# EasyEDA Pro project Jalousee PCB.eprj, board PCB3
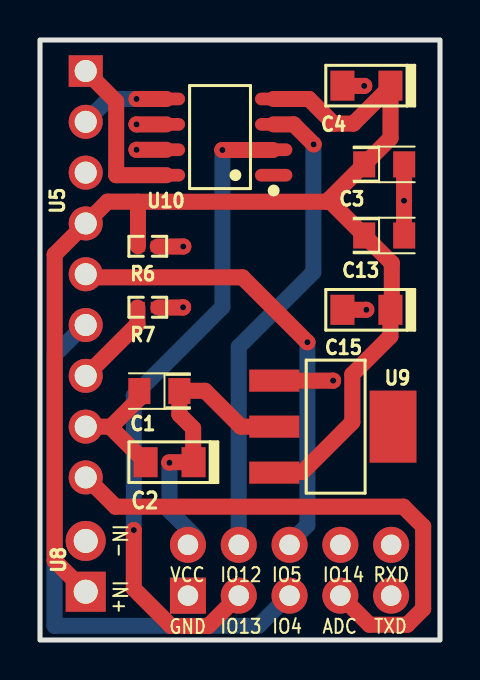
[diagram p11: board, top side]
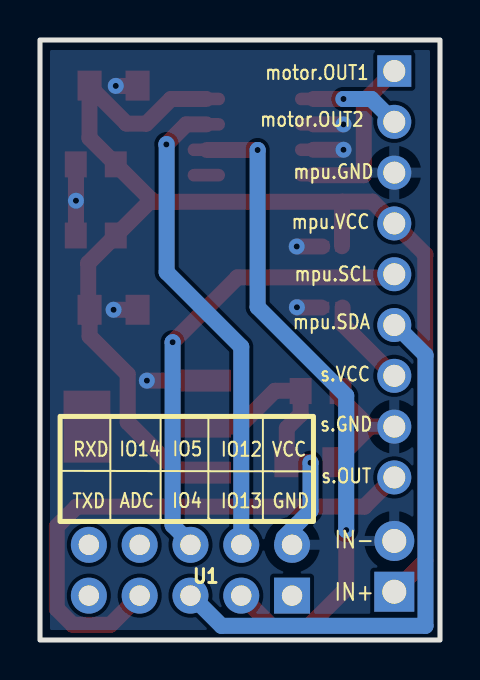
[diagram p12: board, bottom side, seen from below]

Outline 20 x 30 mm; copper layers: Top Layer, Bottom Layer. Coordinates in mm from the lower left corner of the outline.
Outline path: rectangle 0,30 20,0
Stack: Top Layer 0.035mm / Dielectric1 1.51mm FR4 er 4.5 / Bottom Layer 0.035mm

## Design rules (mm)
spacing safeClearance (default): track to track 0.152, other pairs 0.152 to 0.3
track width trackWidth (default): min 0.127, default 0.254, max 2.54
differential pair differentialPair (default): width min 0.127, default 0.254, max 2.54; gap min 0.152, default 0.152
via viaSize (default): diameter min 0.5, default 0.61, max 10; hole min 0.3, default 0.305, max 6

## Placement (name value [footprint] x y rotation side)
C1  10uF  [CAP-SMD_L2.0-W1.3-FD]  5.97 12.45 180 top
C2  100nF  [CAP-SMD_L3.2-W1.6-FD]  6.48 8.89 180 top
C3  10uF  [CAP-SMD_L2.0-W1.3-FD]  17.21 23.78 0 top
C4  100nF  [CAP-SMD_L3.2-W1.6-FD]  16.32 27.72 180 top
C13  10uF  [CAP-SMD_L2.0-W1.3-FD]  17.21 20.22 0 top
C15  100nF  [CAP-SMD_L3.2-W1.6-FD]  16.32 16.51 180 top
R6  1kΩ  [R0402]  5.39 19.68 180 top
R7  4.7kΩ  [R0402]  5.39 16.64 0 top
U1  -  [CONN-TH_10P-P2.54_DEALON_DW254R-22-10-85]  12.48 3.49 0 bottom
U5  -  [HDR-TH_9P-P2.54-V-F]  2.29 18.29 270 top
U8  -  [HDR-TH_2P-P2.54-V-F]  2.29 3.68 90 top
U9  -  [SOT-223-3_L6.5-W3.4-P2.30-LS7.0-BR]  14.68 10.67 180 top
U10  -  [SOP-8_L4.9-W3.9-P1.27-LS6.0-BL]  9 25.15 90 top

## Footprints (pads in the part's own frame, mm; a bottom-side part is the same pattern mirrored in y, then rotated)
CAP-SMD_L2.0-W1.3-FD
  rect 1.1x1.3 smd: 1(-1,0) 2(1,0)
CAP-SMD_L3.2-W1.6-FD
  rect 1.2x1.5 smd: 1(-1.2,0) 2(1.2,0)
CONN-TH_10P-P2.54_DEALON_DW254R-22-10-85
  rect 1.8x1.8 hole 1.02: 1(-5.08,1.27)
  round 1.8 hole 1.02: 2(-5.08,-1.27) 3(-2.54,1.27) 4(-2.54,-1.27) 5(0,1.27) 6(0,-1.27) 7(2.54,1.27) 8(2.54,-1.27) 9(5.08,1.27) 10(5.08,-1.27)
HDR-TH_2P-P2.54-V-F
  rect 2x2 hole 1.2: 1(-1.27,0)
  round 2 hole 1.2: 2(1.27,0)
HDR-TH_9P-P2.54-V-F
  rect 1.575x1.7 hole 1.1: 1(-10.16,0)
  round 1.7 hole 1.1: 2(-7.62,0) 3(-5.08,0) 4(-2.54,0) 5(0,0) 6(2.54,0) 7(5.08,0) 8(7.62,0) 9(10.16,0)
R0402
  rect 0.566x0.54 smd: 1(-0.433,0) 2(0.433,0)
SOP-8_L4.9-W3.9-P1.27-LS6.0-BL
  oval 0.63x1.865 smd: 1(-1.905,-2.683) 2(-0.635,-2.683) 3(0.635,-2.683) 4(1.905,-2.683) 5(1.905,2.683) 6(0.635,2.683) 7(-0.635,2.683) 8(-1.905,2.683)
SOT-223-3_L6.5-W3.4-P2.30-LS7.0-BR
  rect 2.5x1.1 smd: 1(2.97,-2.3) 2(2.97,0) 3(2.97,2.3)
  rect 2.34x3.6 smd: 4(-2.97,0)

## Nets
As in the schematic.

Pads without a net: U1 7 9 10; U9 4; U10 1

## Via types
v1: diameter 0.8, hole 0.305, Top Layer to Bottom Layer, 14 vias

## Routing (per net, layer and track width the routed paths; a pad name or vN(x,y) marks a point on that pad's centre or on a via; arc(x,y) is an arc through that point)
$1N916: length 4.5
  Top Layer w0.8: 4.87,16.62 4.87,15.79 U5.7
$1N918: length 4.5
  Top Layer w0.8: v1(4.83,27.05) U10.5
  Bottom Layer w0.8: v1(4.83,27.05) 3.43,27.05 U5.2
$1N919: length 23
  Top Layer w0.8: U5.5 2.44,18.13 10.13,18.13 v1(13.37,14.89)
  Bottom Layer w0.8: v1(13.37,14.89) 13.37,5.74 12.43,4.8
$1N920: length 24
  Top Layer w0.8: 13.68,24.78 12.69,25.78 11.68,25.78
  Bottom Layer w0.8: 9.94,4.76 9.94,14.66 13.67,18.39 13.67,24.8
  vias: v1(13.68,24.78)
$1N921: length 28.2
  Bottom Layer w0.8: 12.48,2.22 12.48,2.17 12.45,2.14 12.4,2.18 10.93,0.71 0.73,0.71 0.73,14.25 2.27,15.79
$1N922: length 32.9
  Top Layer w0.8: v1(4.69,5.5) 4.69,2.56 6.55,0.7 8.42,0.7 9.94,2.22 ; v1(9.12,24.5) 11.65,24.5
  Bottom Layer w0.8: v1(4.69,5.5) 4.69,12.21 9.12,16.65 v1(9.12,24.5)
$1N923: length 27.1
  Top Layer w0.8: 2.31,8.13 3.78,6.67 18.17,6.67 19.16,5.68 19.16,1.56 18.36,0.76 16.47,0.76 15.02,2.22
$1N924: length 66.6
  Top Layer w0.8: U10.4 13.45,27.05 14.69,25.81 ; 4.82,21.92 3.38,21.92 U5.4 0.73,19.28 0.73,3.96 U8.1 ; C4.1 17.52,27.67 15.67,25.82 14.72,25.82 ; 4.9,19.69 4.9,21.91 14.36,21.91 14.49,22.06 C3.1 17.53,25.1 17.53,27.66 ; 11.74,8.4 13.13,8.4 15.62,10.89 15.62,13.28 17.52,15.19 C15.1 17.59,16.58 17.59,18.84 C13.1 14.47,21.96
$1N925: length 14.9
  Top Layer w0.254: 6.46,8.89 6.46,8.89
  Top Layer w0.8: C1.1 6.97,11.28 7.66,10.59 7.66,8.89 ; 6.97,12.45 6.98,12.46 8.25,12.46 10.05,10.67 U9.2 ; C2.1 6.46,8.89
  Bottom Layer w0.8: 7.82,5.12 6.47,6.46 v1(6.47,8.86)
$1N926: length 20.4
  Top Layer w0.8: 18.22,23.69 18.2,23.67 v1(18.2,21.96) 18.2,20.22 18.18,20.2 ; 11.69,12.96 11.7,12.97 v1(14.66,12.97) ; C15.2 15.12,16.51 16.27,16.51 ; 6.32,25.78 v1(4.83,25.78) ; U5.8 3.5,10.67 ; 3.5,10.67 C2.2 ; 3.5,10.67 3.56,10.67 4.97,12.08 C1.2 ; 15.14,27.69 15.15,27.7 v1(16.21,27.7) ; v1(7.16,19.67) 5.89,19.67 ; v1(7.15,16.64) 7.14,16.62 5.92,16.62 ; U10.7 v1(4.83,24.51)
  vias: v1(16.32,16.51)
$1N4065: length 8.3
  Top Layer w0.8: U5.1 3.81,26.92 3.81,23.24 U10.8

## Copper pours and planes (outline as drawn; the poured copper is in the pictures)
$1N926 on Bottom Layer: -0.13,30.1 20,30.1 20,0 -0.13,0

## Text on the board
Bottom Silkscreen Layer: s.OUT | s.VCC | s.GND | mpu.SCL | mpu.GND | mpu.SDA | mpu.VCC | GND | VCC | motor.OUT1 | motor.OUT2 | IO12 | IO13 | IO5 | IO4 | ADC | IO14 | RXD | TXD | IN- | IN+
Top Silkscreen Layer: GND | VCC | IO12 | IO13 | IO5 | IO4 | ADC | IO14 | RXD | TXD | IN- | IN+ | C2
